# Altium schematic sheet BridgeRF.SchDoc
size A4
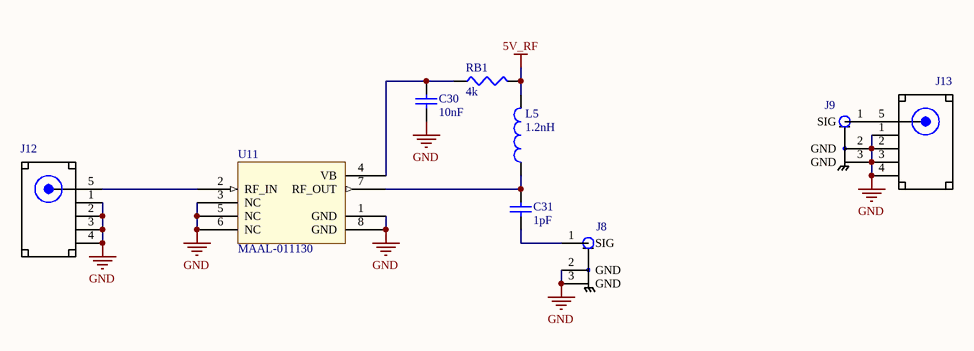
[diagram p0: BridgeRF.SchDoc]

## Parts
C30  10nF  [CAPC0603(1608)100_L]
C31  1pF  [CAPC1608X90X35LL10T15]
J8  1909763-1  [TE_1909763-1]  (value not drawn)
J9  1909763-1  [TE_1909763-1]  (value not drawn)
J12  5-1814400-1  [CONN_5-1814400-1]  (value not drawn)
J13  5-1814400-1  [CONN_5-1814400-1]  (value not drawn)
L5  1.2nH  [INDC1608L]
RB1  4k  [J1-0603]
U11  MAAL-011130  [PQFN50P200X200X100_HS-9N]

## Nets
5V_RF: L5.2 RB1.1
GND: C30.1 J8.2(GND) J8.3(GND) J9.2(GND) J9.3(GND) J12.1(GND) J12.2(GND) J12.3(GND) J12.4(GND) J13.1(GND) J13.2(GND) J13.3(GND) J13.4(GND) U11.1(GND) U11.3(NC) U11.5(NC) U11.6(NC) U11.8(GND)
NetC30_2: C30.2 RB1.2 U11.4(VB)
NetC31_1: C31.1 J8.1(SIG)
NetC31_2: C31.2 L5.1 U11.7(RF_OUT)
NetJ9_1: J9.1(SIG) J13.5(SIGNAL)
NetJ12_5: J12.5(SIGNAL) U11.2(RF_IN)

## Library data of the parts
C30 = CMP-1035-02302-1: CAP 10nF 6.3V ±10% 0603 (1608 Metric) Thickness 1mm SMD; Case-EIA: 0603; Case-Metric: 1608; Tolerance: Â±10%; Value: 10nF; Max Thickness: 1 mm; Rated Voltage: 6.3 V; Technology: SMT
C31 = CMP-2006-02464-1: Manufacturer: Murata; Part Number: GRM1885C1H1R0CA01D; Value: 1pF
J8 J9 = 1909763-1: CONN UMCC JACK STR 50OHM SMD; Number_of_Positions: 1; MF: TE Connectivity; Availability: Good; MP: 1909763-1; Price: 0.28 USD; Package: None; Value: *
J12 J13 = 5-1814400-1: SMA R/A PCB Skt GZD; Number_of_Positions: 1; MF: TE Connectivity; Digi-Key_Purchase_URL: https://www.digikey.com/product-detail/en/te-connectivity-amp-connectors/5-1814400-1/A97593-ND/1755981?WT.z_cid=ref_snapeda&utm_source=snapeda&utm_medium=aggregator&utm_campaign=buynow; Digi-Key_Part_Number: A97593-ND; EU_RoHS_Compliance: Compliant; Package: None; MP: 5-1814400-1; Link: http://www.te.com/usa-en/product-5-1814400-1.html; SnapEDA_Link: https://www.snapeda.com/symbols-footprints/5-1814400-1/TE%20Connectivity%20AMP%20Connectors/view-part/?ref=snap; Value: *
L5 = Inductor: Part Number: LQG15WH1N2S02D; Manufacturer: Murata; Value: 1.2nH
RB1 = Res3: Resistor; Published: 8-Jun-2000; LatestRevisionDate: 29-May-2009; LatestRevisionNote: IPC-7351 Footprint Added.; PackageReference: J1-0603; Publisher: Altium Limited; PackageDescription: Chip Resistor; Value: 4k